# EAGLE design turbidity_sensor_module (EAGLE 6.1)
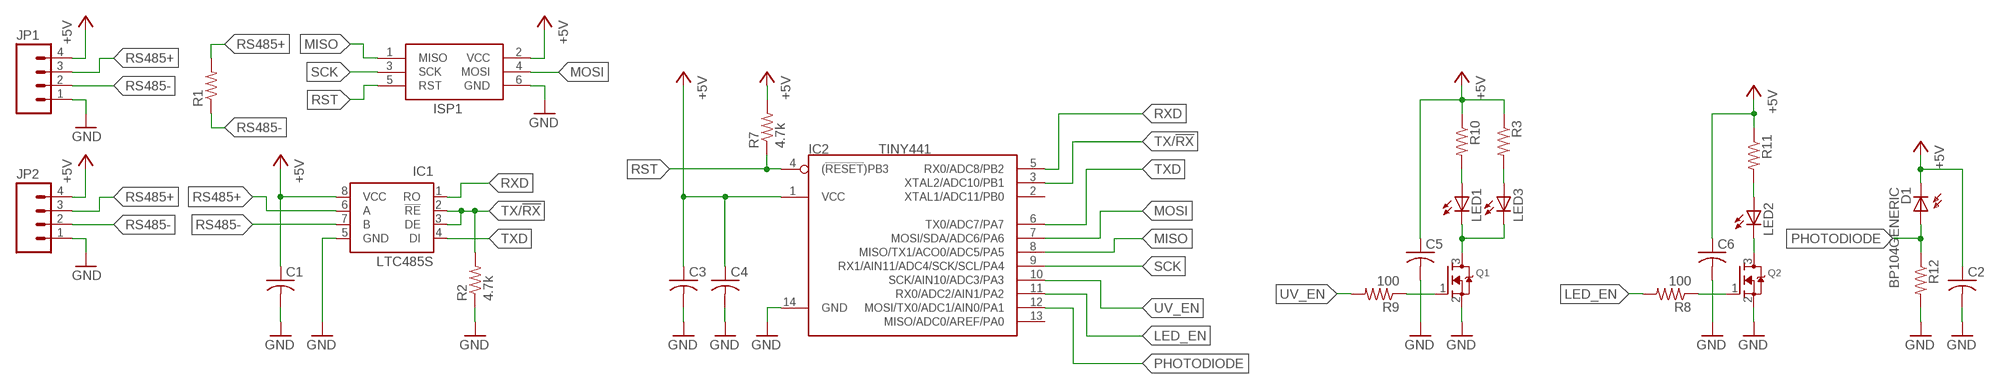
[diagram p0: schematic, sheet 1]

## Parts
C1  C-USC1206  [C1206]
C2  C-USC1206  [C1206]
C3  C-USC1206  [C1206]
C4  C-USC1206  [C1206]
C5  C-USC1206  [C1206]
C6  C-USC1206  [C1206]
D1  BP104GENERIC  [PHOTODIODE]
IC1  LTC485S  [SOIC8]
IC2  TINY441  [SOIC14]
ISP1  AVRISP-6  [AVRISP]
JP1  M04LONGPADS  [1X04_LONGPADS]
JP2  M04LONGPADS  [1X04_LONGPADS]
LED1  LED5MM  [LED5MM]
LED2  LED5MM  [LED5MM]
LED3  LED5MM  [LED5MM]
Q1  MOSFET-NREFLOW  [SOT23]
Q2  MOSFET-NREFLOW  [SOT23]
R1  R-US_R1206  [R1206]
R2  4.7k  R-US_R1206  [R1206]
R3  R-US_R1206  [R1206]
R7  4.7k  R-US_R1206  [R1206]
R8  100  R-US_R1206  [R1206]
R9  100  R-US_R1206  [R1206]
R10  R-US_R1206  [R1206]
R11  R-US_R1206  [R1206]
R12  R-US_R1206  [R1206]

## Nets
+5V: C1.1 C2.1 C3.1 C4.1 C5.1 C6.1 D1.K(C) IC1.8(VCC) IC2.1(VCC) ISP1.2(VCC) JP1.4 JP2.4 R3.1 R7.2 R10.1 R11.1
GND: C1.2 C2.2 C3.2 C4.2 C5.2 C6.2 IC1.5(GND) IC2.14(GND) ISP1.6(GND) JP1.1 JP2.1 Q1.2(S) Q2.2(S) R2.1 R12.2
LED_EN: IC2.11(RX0/ADC2/AIN1/PA2) R8.2
MISO: IC2.8(MISO/TX1/ACO0/ADC5/PA5) ISP1.1(MISO)
MOSI: IC2.7(MOSI/SDA/ADC6/PA6) ISP1.4(MOSI)
N$1: Q2.1(G) R8.1
N$2: Q1.1(G) R9.1
N$3: LED1.A R10.2
N$4: LED2.A R11.2
N$5: LED1.K(C) LED3.K(C) Q1.3(D)
N$6: LED2.K(C) Q2.3(D)
N$7: LED3.A R3.2
PHOTODIODE: D1.A IC2.12(MOSI/TX0/ADC1/AIN0/PA1) R12.1
RS485+: IC1.6(A) JP1.3 JP2.3 R1.2
RS485-: IC1.7(B) JP1.2 JP2.2 R1.1
RST: IC2.4((!RESET!)PB3) ISP1.5(RST) R7.1
RXD: IC1.1(RO) IC2.5(RX0/ADC8/PB2)
SCK: IC2.9(RX1/AIN11/ADC4/SCK/SCL/PA4) ISP1.3(SCK)
TX/!RX: IC1.2(!RE) IC1.3(DE) IC2.3(XTAL2/ADC10/PB1) R2.2
TXD: IC1.4(DI) IC2.6(TX0/ADC7/PA7)
UV_EN: IC2.10(SCK/AIN10/ADC3/PA3) R9.2
Unconnected: IC2.2(XTAL1/ADC11/PB0) IC2.13(MISO/ADC0/AREF/PA0)

## Library data of the parts
C1-C6 = adafruit:C-US: CAPACITOR, American symbol
D1 = opto-trans-siemens:BP104: PHOTO DIODE
IC1 = linear-technology:LTC485: Low Power RS485 Interface Transceiver Source: http://www.linear.com/pc/downloadDocument.do?navId=H0,C1,C1007,C1017,P2064,D1718; OC_FARNELL: unknown; OC_NEWARK: unknown
IC2 = atmel:TINY441
ISP1 = adafruit:AVRISP: AVR ISP HEADER Standard 6 pin header for AVR programming
JP1 JP2 = sparkfun:M04: Header 4 Standard 4-pin 0.1" header. Use with straight break away headers (SKU : PRT-00116), right angle break away headers (PRT-00553), swiss pins (PRT-00743), machine pins (PRT-00117), and female headers (PRT-00115). Molex polarized connector foot print use with SKU : PRT-08231 with associated crimp pins and housings. 1MM SMD Version SKU: PRT-10208
LED1-LED3 = adafruit:LED: LED OSRAM: - CHIPLED LG R971, LG N971, LY N971, LG Q971, LY Q971, LO R971, LY R971 LH N974, LH R974 LS Q976, LO Q976, LY Q976 LO Q996 - Hyper CHIPLED LW Q18S LB Q993, LB Q99A, LB R99A - SideLED LS A670, LO A670, LY A670, LG A670, LP A670 LB A673, LV A673, LT A673, LW A673 LH A674 LY A675 LS A676, LA A676, LO A676, LY A676, LW A676 LS A679, LY A679, LG A679 - Hyper Micro SIDELED® LS Y876, LA Y876, LO Y876, LY Y876 LT Y87S - SmartLED LW L88C, LW L88S LB L89C, LB L89S, LG L890 LS L89K, LO L89K, LY L89K LS L896, LA L896, LO L896, LY L896 - TOPLED LS T670, LO T670, LY T670, LG T670, LP T670 LSG T670, LSP T670, LSY T670, LOP T670, LYG T670 LG T671, LOG T671, LSG T671 LB T673, LV T673, LT T673, LW T673 LH T674 LS T676, LA T676, LO T676, LY T676, LB T676, LH T676, LSB T676, LW T676 LB T67C, LV T67C, LT T67C, LS T67K, LO T67K, LY T67K, LW E67C LS E67B, LA E67B, LO E67B, LY E67B, LB E67C, LV E67C, LT E67C LW T67C LS T679, LY T679, LG T679 LS T770, LO T770, LY T770, LG T770, LP T770 LB T773, LV T773, LT T773, LW T773 LH T774 LS E675, LA E675, LY E675, LS T675 LS T776, LA T776, LO T776, LY T776, LB T776 LHGB T686 LT T68C, LB T68C - Hyper Mini TOPLED® LB M676 - Mini TOPLED Santana® LG M470 LS M47K, LO M47K, LY M47K Source: http://www.osram.convergy.de/
Q1 Q2 = adafruit:MOSFET-N: N-Channel Mosfet 2N7002E - 60V 260mA SOT23 [Digikey: 2N7002ET1GOSTR-ND] - REEL BSH103 - 30V 850mA SOT23 [Digikey: 568-5013-1-ND]
R1-R3 R7-R12 = adafruit:R-US_: RESISTOR, American symbol

## Board
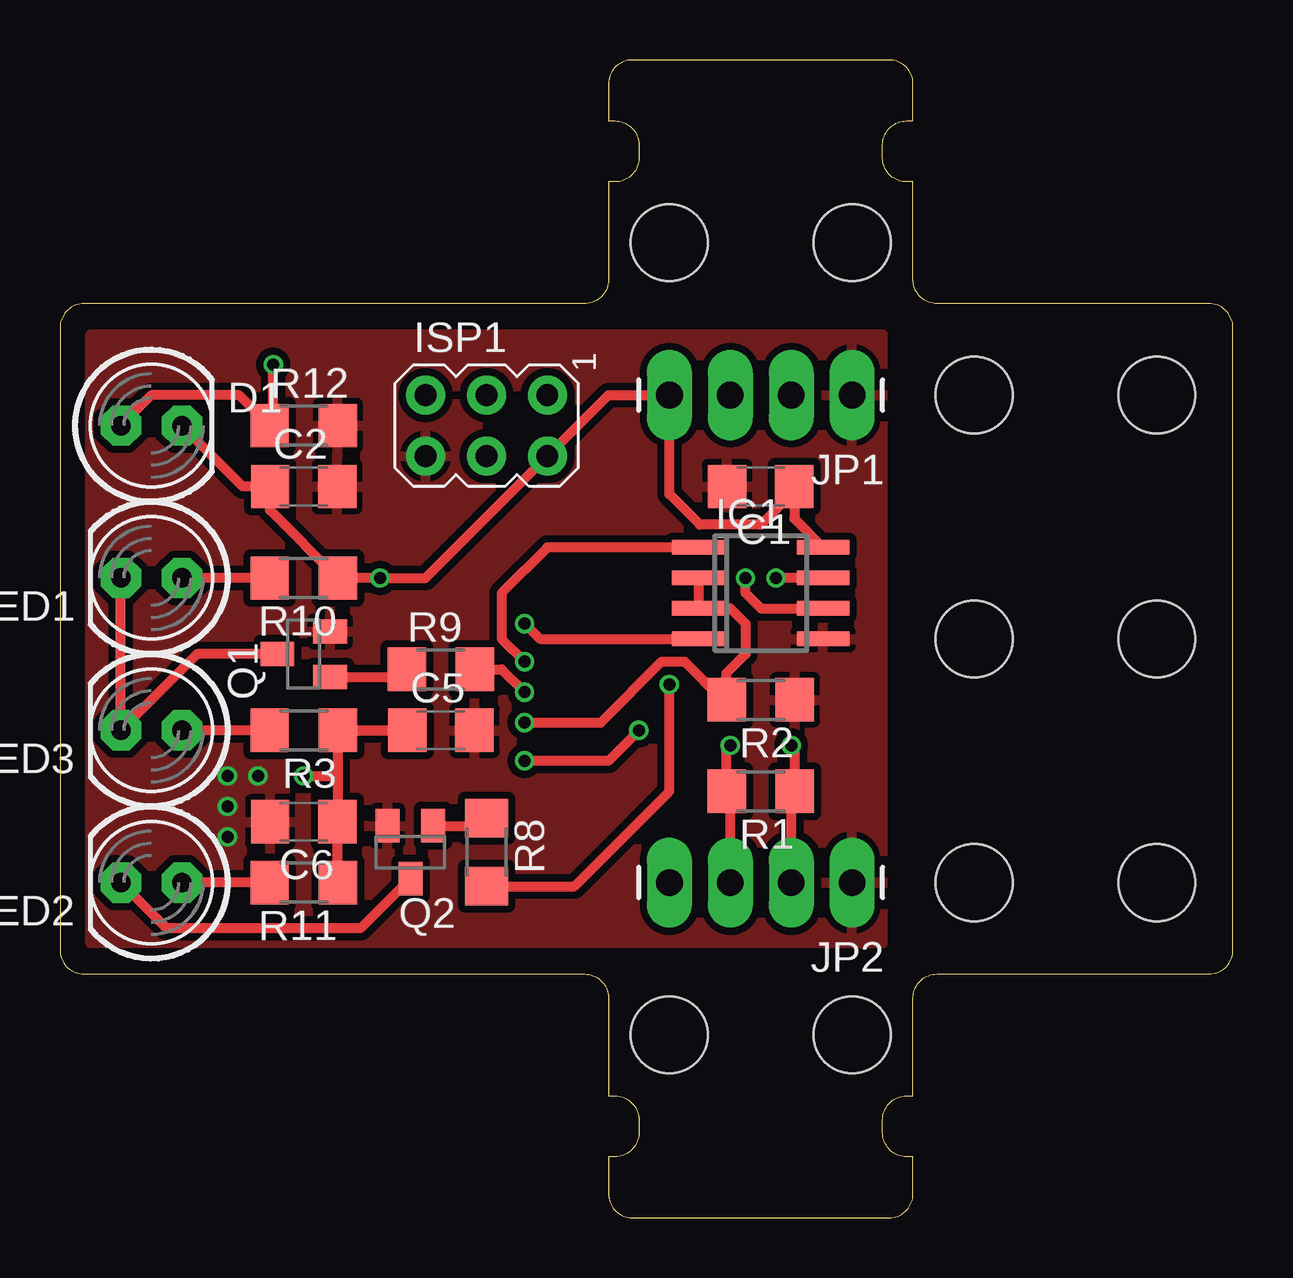
[diagram p1: board, top side]
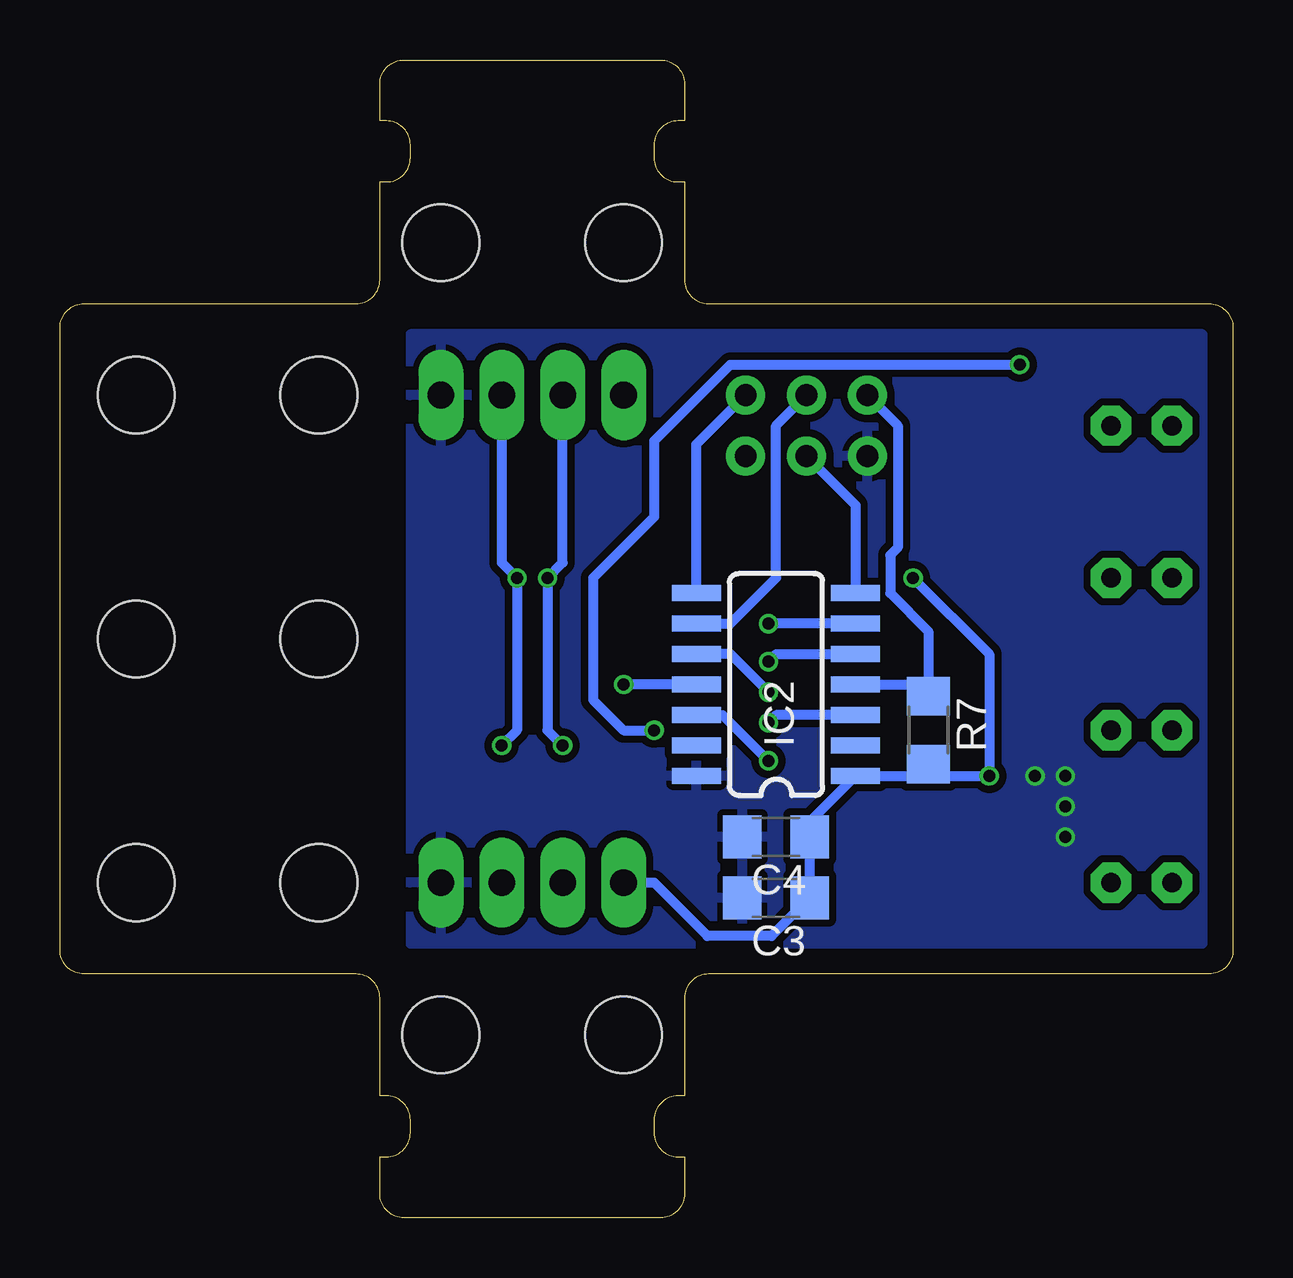
[diagram p2: board, bottom side, seen from below]

Size 48.9 x 48.26 mm. Coordinates in mm from the lower left corner, seen from the top.
Outline: 21.86,38.1 1,38.1 arc90 0,37.1 0,11.16 arc90 1,10.16 21.86,10.16 arc-90 22.86,9.16 22.86,5.08 23.13,5.08 arc-90 24.13,4.08 24.13,3.54 arc-90 23.13,2.54 22.86,2.54 22.86,1 arc90 23.86,0 34.56,0 arc90 35.56,1 35.56,2.54 35.29,2.54 arc-90 34.29,3.54 34.29,4.08 arc-90 35.29,5.08 35.56,5.08 35.56,9.16 arc-90 36.56,10.16 47.9,10.16 arc90 48.9,11.16 48.9,37.1 arc90 47.9,38.1 36.56,38.1 arc-90 35.56,39.1 35.56,43.18 35.29,43.18 arc-90 34.29,44.18 34.29,44.72 arc-90 35.29,45.72 35.56,45.72 35.56,47.26 arc90 34.56,48.26 23.86,48.26 arc90 22.86,47.26 22.86,45.72 23.13,45.72 arc-90 24.13,44.72 24.13,44.18 arc-90 23.13,43.18 22.86,43.18 22.86,39.1 arc-90 21.86,38.1
Copper layers (1*16): Top 0.035mm / dielectric 1.5mm / Bottom 0.035mm
Design rules: minimum track width 6mil, minimum drill 12mil, track to track 6mil, track to pad 6mil, pad to pad 6mil, via to via 6mil, smd to smd 0mil, copper to edge 10mil, drill to drill 10mil, minimum pad ring 10mil, minimum via ring 6mil, stop-mask expansion 2mil, vias tented up to drill 100mil, thermal gap 10mil
Holes 3.2 mm at 38.1,13.97 45.72,13.97 38.1,34.29 45.72,34.29 38.1,24.13 45.72,24.13 25.4,7.62 33.02,7.62 25.4,40.64 33.02,40.64

### Footprints (pad centres in the part's own frame; a part is rotated, then mirrored left to right if it is on the bottom)
C1206 = smd 1.6 x 1.8: 1 -1.4,0; 2 1.4,0
PHOTODIODE = drill 0.813 pad 1.676 octagon: A -1.27,0; K 1.27,0
SOIC8 = smd 0.6 x 2.2: 1 -1.905,-2.6; 2 -0.635,-2.6; 3 0.635,-2.6; 4 1.905,-2.6; 5 1.905,2.6; 6 0.635,2.6; 7 -0.635,2.6; 8 -1.905,2.6
SOIC14 = smd 0.66 x 2.032: 1 -3.175,-3.315; 2 -1.905,-3.315; 3 -0.635,-3.315; 4 0.635,-3.315; 5 1.905,-3.315; 6 3.175,-3.315; 7 4.445,-3.315; 8 4.445,3.315; 9 3.175,3.315; 10 1.905,3.315; 11 0.635,3.315; 12 -0.635,3.315; 13 -1.905,3.315; 14 -3.175,3.315
AVRISP = drill 0.9 pad 1.626: 1 -1.27,2.54; 2 1.27,2.54; 3 -1.27,0; 4 1.27,0; 5 -1.27,-2.54; 6 1.27,-2.54
1X04_LONGPADS = drill 1.118 pad 1.88 long: 1 0,0; 2 2.54,0; 3 5.08,0; 4 7.62,0
LED5MM = drill 0.813 pad 1.676 octagon: A -1.27,0; K 1.27,0
SOT23 = smd 1 x 1.4: 1 -0.95,-1.1; 2 0.95,-1.1; 3 0,1.1
R1206 = smd 1.6 x 1.803: 1 -1.422,0; 2 1.422,0

### Placement (x,y rotation side)
C1  29.21,30.48 180 top
C2  10.16,30.48 0 top
C3  19.05,13.34 180 bottom
C4  19.05,15.88 180 bottom
C5  15.88,20.32 0 top
C6  10.16,16.51 180 top
D1  3.81,33.02 0 top
IC1  29.21,26.04 270 top
IC2  19.05,21.59 90 bottom
ISP1  17.78,33.02 270 top
JP1  33.02,34.29 180 top
JP2  33.02,13.97 180 top
LED1  3.81,26.67 180 top
LED2  3.81,13.97 180 top
LED3  3.81,20.32 180 top
Q1  10.16,23.5 90 top
Q2  14.61,15.24 180 top
R1  29.21,17.78 180 top
R2  29.21,21.59 180 top
R3  10.16,20.32 180 top
R7  12.7,20.32 270 bottom
R8  17.78,15.24 270 top
R9  15.88,22.86 0 top
R10  10.16,26.67 180 top
R11  10.16,13.97 180 top
R12  10.16,33.02 0 top

### Tracks (layer width: path | path; a pad name or v marks a point on that pad's centre or on a via)
+5V  (via drill 0.5)
  Top 0.406: IC1.8 30.61,29.14 C1.1 30.61,30.29 29.21,28.89 26.67,28.89 25.4,30.16 JP1.4 22.86,34.29 ISP1.2 15.24,26.67 v13.34,26.67 R10.1 8.76,29.49 C2.1 7.62,30.48 D1.K | C5.1 R3.1 | 11.43,20.32 R3.1 | R3.1 11.58,18.41 | 11.58,18.41 11.58,16.53 C6.1 11.56,13.99 R11.1 | R3.1 11.58,18.9 | R3.1 14.61,20.32 | v10.16,18.41 11.58,18.41
  Bottom 0.406: v13.34,26.67 10.16,23.5 v10.16,18.41 12.22,18.41 R7.2 13.18,18.41 IC2.1 17.65,16.5 C4.1 C3.1 19.24,11.75 21.91,11.75 24.13,13.97 JP2.4
GND  (via drill 0.5)
  other vias: 8.26,18.41 6.99,18.41 6.99,17.14 6.99,15.88
  pour Top (isolate 0.305): 1.27,36.83 34.29,36.83 34.29,11.43 1.27,11.43
  pour Bottom (isolate 0.305): 1.27,36.83 34.29,36.83 34.29,11.43 1.27,11.43
LED_EN  (via drill 0.5)
  Top 0.406: R8.2 21.44,13.82 25.4,17.78 v25.4,22.23
  Bottom 0.406: IC2.11 v25.4,22.23
MISO
  Bottom 0.406: IC2.8 22.36,32.25 ISP1.1
MOSI
  Bottom 0.406: ISP1.4 15.73,29.71 IC2.7
N$1
  Top 0.406: Q2.1 17.46,16.34 R8.1
N$2
  Top 0.406: Q1.1 14.14,22.55 R9.1
N$3
  Top 0.406: R10.2 LED1.A
N$4
  Top 0.406: R11.2 LED2.A
N$5
  Top 0.406: LED1.K LED3.K 5.71,23.5 Q1.3
N$6
  Top 0.406: Q2.3 12.53,12.06 4.45,12.06 LED2.K
N$7
  Top 0.406: R3.2 LED3.A
PHOTODIODE  (via drill 0.5)
  Top 0.406: v8.89,35.56 8.89,33.02 R12.1 7.47,34.29 3.81,34.29 D1.A | v24.13,20.32 22.86,19.05 v19.37,19.05
  Bottom 0.406: v24.13,20.32 25.4,20.32 26.67,21.59 26.67,26.67 24.13,29.21 24.13,32.39 20.95,35.56 v8.89,35.56 | IC2.12 21.27,20.95 v19.37,19.05
RS485+  (via drill 0.5)
  Top 0.406: JP2.3 27.94,17.63 R1.2 27.79,19.53 v27.94,19.69 | IC1.6 29.21,25.4 28.57,26.04 v28.57,26.67
  Bottom 0.406: JP1.3 27.94,27.3 v28.57,26.67 28.57,20.32 v27.94,19.69
RS485-  (via drill 0.5)
  Top 0.406: JP2.2 30.48,17.63 R1.1 30.63,19.53 v30.48,19.69 | IC1.7 v29.84,26.67
  Bottom 0.406: JP1.2 30.48,27.3 v29.84,26.67 29.84,20.32 v30.48,19.69
RST
  Bottom 0.406: IC2.4 13.18,22.23 R7.1 | ISP1.5 13.97,33.02 13.97,27.94 14.29,27.62 14.29,26.04 12.7,24.45 R7.1 | R7.1 12.7,21.59
RXD  (via drill 0.5)
  Top 0.406: IC1.1 20.32,27.94 18.41,26.04 18.41,24.13 v19.37,23.18
  Bottom 0.406: v19.37,23.18 19.05,23.5 IC2.5
SCK
  Bottom 0.406: IC2.9 20.95,24.77 19.05,26.67 19.05,33.02 ISP1.3
TX/!RX  (via drill 0.5)
  Top 0.406: IC1.2 IC1.3 27.94,25.4 28.57,24.77 28.57,23.5 27.79,22.71 R2.2 27.62,21.59 26.04,23.18 25.08,23.18 22.54,20.64 v19.37,20.64
  Bottom 0.406: IC2.3 19.05,20.95 v19.37,20.64
TXD  (via drill 0.5)
  Top 0.406: v19.37,24.77 20,24.13 IC1.4
  Bottom 0.406: IC2.6 v19.37,24.77
UV_EN  (via drill 0.5)
  Top 0.406: R9.2 18.41,22.86 v19.37,21.91
  Bottom 0.406: v19.37,21.91 20.95,23.5 IC2.10